# EAGLE design board (EAGLE 9.6.2)
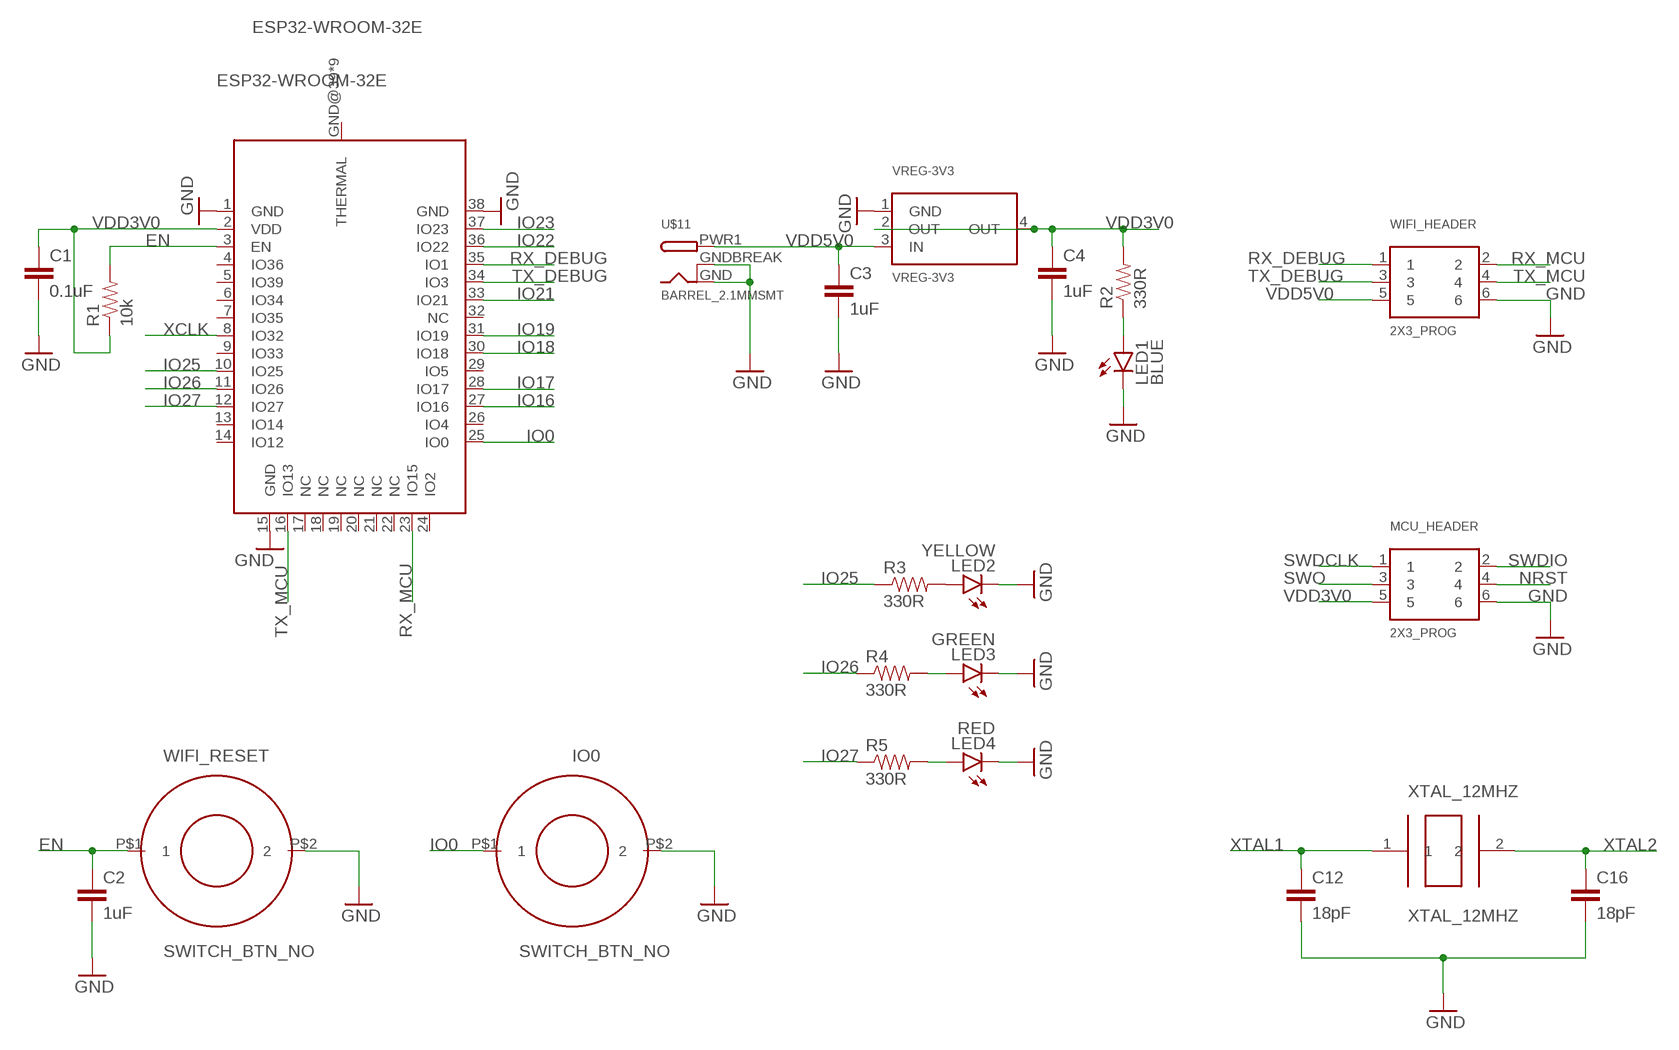
[diagram p0: schematic, sheet 1, part 1 of 2]
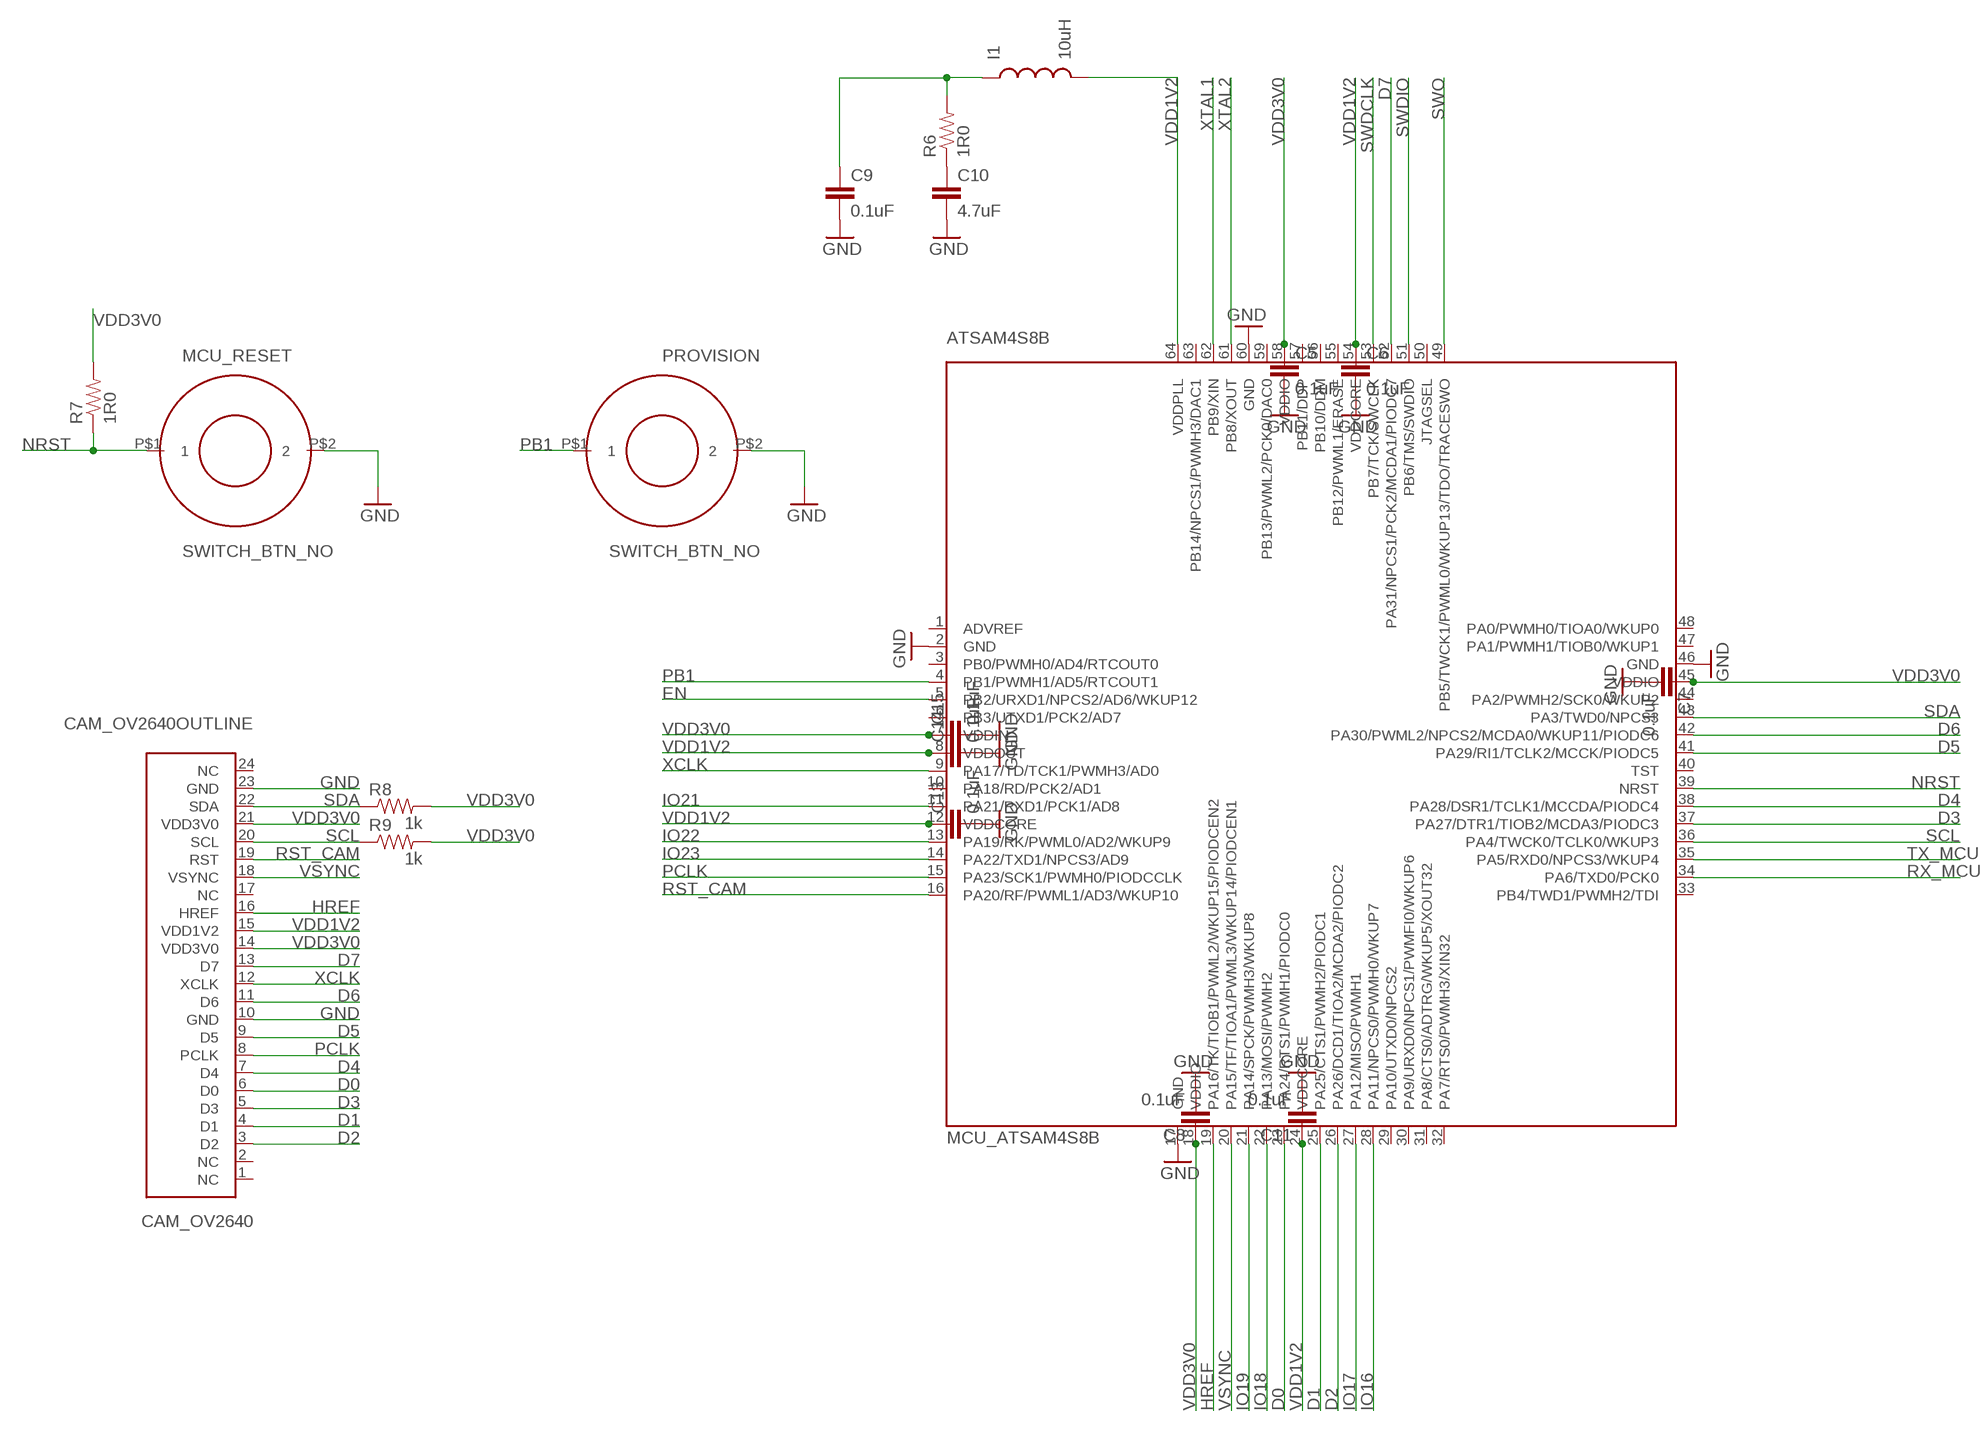
[diagram p1: schematic, sheet 1, part 2 of 2]

## Parts
ATSAM4S8B  MCU_ATSAM4S8B  [QFP50P1200X1200X160-64N]
C1  0.1uF  CAP  [0805]
C2  1uF  CAP  [0805]
C3  1uF  CAP  [0805]
C4  1uF  CAP  [0805]
C5  0.1uF  CAP  [0805]
C6  0.1uF  CAP  [0805]
C7  0.1uF  CAP  [0805]
C8  0.1uF  CAP  [0805]
C9  0.1uF  CAP  [0805]
C10  4.7uF  CAP  [0805]
C11  0.1uF  CAP  [0805]
C12  18pF  CAP  [0805]
C13  0.1uF  CAP  [0805]
C14  0.1uF  CAP  [0805]
C15  0.1uF  CAP  [0805]
C16  18pF  CAP  [0805]
CAM_OV2640  CAM_OV2640OUTLINE  [CAM_CONN]
ESP32-WROOM-32E  ESP32-WROOM-32E  [ESP32-WROOM-32E]
I1  10uH  IND  [0805]
IO0  SWITCH_BTN_NO  [BTN_2]
LED1  BLUE  LED0603  [LED-0603]
LED2  YELLOW  LED0603  [LED-0603]
LED3  GREEN  LED0603  [LED-0603]
LED4  RED  LED0603  [LED-0603]
MCU_HEADER  2X3_PROG  [2X3_0.1IN]
MCU_RESET  SWITCH_BTN_NO  [BTN_2]
PROVISION  SWITCH_BTN_NO  [BTN_2]
R1  10k  RES  [0805]
R2  330R  RES  [0805]
R3  330R  RES  [0805]
R4  330R  RES  [0805]
R5  330R  RES  [0805]
R6  1R0  RES  [0805]
R7  1R0  RES  [0805]
R8  1k  RES  [0805]
R9  1k  RES  [0805]
U$11  BARREL_2.1MMSMT  [DCJACK_2MM_SMT]
VREG-3V3  VREG-3V3  [R-PDSO-G4_TI]
WIFI_HEADER  2X3_PROG  [2X3_0.1IN]
WIFI_RESET  SWITCH_BTN_NO  [BTN_2]
XTAL_12MHZ  XTAL_12MHZ  [ABM7-16.000MHZ-D2Y-T]

## Nets
D0: ATSAM4S8B.23(PA24/RTS1/PWMH1/PIODC0) CAM_OV2640.6(D0)
D1: ATSAM4S8B.25(PA25/CTS1/PWMH2/PIODC1) CAM_OV2640.4(D1)
D2: ATSAM4S8B.26(PA26/DCD1/TIOA2/MCDA2/PIODC2) CAM_OV2640.3(D2)
D3: ATSAM4S8B.37(PA27/DTR1/TIOB2/MCDA3/PIODC3) CAM_OV2640.5(D3)
D4: ATSAM4S8B.38(PA28/DSR1/TCLK1/MCCDA/PIODC4) CAM_OV2640.7(D4)
D5: ATSAM4S8B.41(PA29/RI1/TCLK2/MCCK/PIODC5) CAM_OV2640.9(D5)
D6: ATSAM4S8B.42(PA30/PWML2/NPCS2/MCDA0/WKUP11/PIODC6) CAM_OV2640.11(D6)
D7: ATSAM4S8B.52(PA31/NPCS1/PCK2/MCDA1/PIODC7) CAM_OV2640.13(D7)
EN: ATSAM4S8B.5(PB2/URXD1/NPCS2/AD6/WKUP12) C2.1 ESP32-WROOM-32E.3(EN) R1.2 WIFI_RESET.P$1
GND: ATSAM4S8B.2(GND) ATSAM4S8B.17(GND) ATSAM4S8B.46(GND) ATSAM4S8B.60(GND) C1.2 C2.2 C3.2 C4.2 C5.2 C6.2 C7.2 C8.2 C9.2 C10.2 C11.2 C12.2 C13.2 C14.2 C15.2 C16.2 CAM_OV2640.10(GND) CAM_OV2640.23(GND) ESP32-WROOM-32E.1(GND) ESP32-WROOM-32E.15(GND) ESP32-WROOM-32E.38(GND) IO0.P$2 LED1.C LED2.C LED3.C LED4.C MCU_HEADER.6 MCU_RESET.P$2 PROVISION.P$2 U$11.GND U$11.GNDBREAK VREG-3V3.1(GND) WIFI_HEADER.6 WIFI_RESET.P$2
HREF: ATSAM4S8B.19(PA16/TK/TIOB1/PWML2/WKUP15/PIODCEN2) CAM_OV2640.16(HREF)
IO0: ESP32-WROOM-32E.25(IO0) IO0.P$1
IO16: ATSAM4S8B.28(PA11/NPCS0/PWMH0/WKUP7) ESP32-WROOM-32E.27(IO16)
IO17: ATSAM4S8B.27(PA12/MISO/PWMH1) ESP32-WROOM-32E.28(IO17)
IO18: ATSAM4S8B.22(PA13/MOSI/PWMH2) ESP32-WROOM-32E.30(IO18)
IO19: ATSAM4S8B.21(PA14/SPCK/PWMH3/WKUP8) ESP32-WROOM-32E.31(IO19)
IO21: ATSAM4S8B.11(PA21/RXD1/PCK1/AD8) ESP32-WROOM-32E.33(IO21)
IO22: ATSAM4S8B.13(PA19/RK/PWML0/AD2/WKUP9) ESP32-WROOM-32E.36(IO22)
IO23: ATSAM4S8B.14(PA22/TXD1/NPCS3/AD9) ESP32-WROOM-32E.37(IO23)
IO25: ESP32-WROOM-32E.10(IO25) R3.1
IO26: ESP32-WROOM-32E.11(IO26) R4.1
IO27: ESP32-WROOM-32E.12(IO27) R5.1
N$1: LED1.A R2.1
N$2: LED2.A R3.2
N$3: LED3.A R4.2
N$4: LED4.A R5.2
N$5: C10.1 R6.1
N$6: C9.1 I1.1 R6.2
NRST: ATSAM4S8B.39(NRST) MCU_HEADER.4 MCU_RESET.P$1 R7.1
PB1: ATSAM4S8B.4(PB1/PWMH1/AD5/RTCOUT1) PROVISION.P$1
PCLK: ATSAM4S8B.15(PA23/SCK1/PWMH0/PIODCCLK) CAM_OV2640.8(PCLK)
RST_CAM: ATSAM4S8B.16(PA20/RF/PWML1/AD3/WKUP10) CAM_OV2640.19(RST)
RX_DEBUG: ESP32-WROOM-32E.35(IO1) WIFI_HEADER.1
RX_MCU: ATSAM4S8B.34(PA6/TXD0/PCK0) ESP32-WROOM-32E.23(IO15) WIFI_HEADER.2
SCL: ATSAM4S8B.36(PA4/TWCK0/TCLK0/WKUP3) CAM_OV2640.20(SCL) R9.1
SDA: ATSAM4S8B.43(PA3/TWD0/NPCS3) CAM_OV2640.22(SDA) R8.1
SWDCLK: ATSAM4S8B.53(PB7/TCK/SWCLK) MCU_HEADER.1
SWDIO: ATSAM4S8B.51(PB6/TMS/SWDIO) MCU_HEADER.2
SWO: ATSAM4S8B.49(PB5/TWCK1/PWML0/WKUP13/TDO/TRACESWO) MCU_HEADER.3
TX_DEBUG: ESP32-WROOM-32E.34(IO3) WIFI_HEADER.3
TX_MCU: ATSAM4S8B.35(PA5/RXD0/NPCS3/WKUP4) ESP32-WROOM-32E.16(IO13) WIFI_HEADER.4
VDD1V2: ATSAM4S8B.8(VDDOUT) ATSAM4S8B.12(VDDCORE) ATSAM4S8B.24(VDDCORE) ATSAM4S8B.54(VDDCORE) ATSAM4S8B.64(VDDPLL) C6.1 C11.1 C13.1 C14.1 CAM_OV2640.15(VDD1V2) I1.2
VDD3V0: ATSAM4S8B.7(VDDIN) ATSAM4S8B.18(VDDIO) ATSAM4S8B.45(VDDIO) ATSAM4S8B.58(VDDIO) C1.1 C4.1 C5.1 C7.1 C8.1 C15.1 CAM_OV2640.14(VDD3V0) CAM_OV2640.21(VDD3V0) ESP32-WROOM-32E.2(VDD) MCU_HEADER.5 R1.1 R2.2 R7.2 R8.2 R9.2 VREG-3V3.2(OUT) VREG-3V3.4(OUT)
VDD5V0: C3.1 U$11.PWR1(PWR) VREG-3V3.3(IN) WIFI_HEADER.5
VSYNC: ATSAM4S8B.20(PA15/TF/TIOA1/PWML3/WKUP14/PIODCEN1) CAM_OV2640.18(VSYNC)
XCLK: ATSAM4S8B.9(PA17/TD/TCK1/PWMH3/AD0) CAM_OV2640.12(XCLK) ESP32-WROOM-32E.8(IO32)
XTAL1: ATSAM4S8B.62(PB9/XIN) C12.1 XTAL_12MHZ.1
XTAL2: ATSAM4S8B.61(PB8/XOUT) C16.1 XTAL_12MHZ.2
Unconnected: ATSAM4S8B.1(ADVREF) ATSAM4S8B.3(PB0/PWMH0/AD4/RTCOUT0) ATSAM4S8B.6(PB3/UTXD1/PCK2/AD7) ATSAM4S8B.10(PA18/RD/PCK2/AD1) ATSAM4S8B.29(PA10/UTXD0/NPCS2) ATSAM4S8B.30(PA9/URXD0/NPCS1/PWMFI0/WKUP6) ATSAM4S8B.31(PA8/CTS0/ADTRG/WKUP5/XOUT32) ATSAM4S8B.32(PA7/RTS0/PWMH3/XIN32) ATSAM4S8B.33(PB4/TWD1/PWMH2/TDI) ATSAM4S8B.40(TST) ATSAM4S8B.44(PA2/PWMH2/SCK0/WKUP2) ATSAM4S8B.47(PA1/PWMH1/TIOB0/WKUP1) ATSAM4S8B.48(PA0/PWMH0/TIOA0/WKUP0) ATSAM4S8B.50(JTAGSEL) ATSAM4S8B.55(PB12/PWML1/ERASE) ATSAM4S8B.56(PB10/DDM) ATSAM4S8B.57(PB11/DDP) ATSAM4S8B.59(PB13/PWML2/PCK0/DAC0) ATSAM4S8B.63(PB14/NPCS1/PWMH3/DAC1) CAM_OV2640.1(NC) CAM_OV2640.2(NC) CAM_OV2640.17(NC) CAM_OV2640.24(NC) ESP32-WROOM-32E.4(IO36) ESP32-WROOM-32E.5(IO39) ESP32-WROOM-32E.6(IO34) ESP32-WROOM-32E.7(IO35) ESP32-WROOM-32E.9(IO33) ESP32-WROOM-32E.13(IO14) ESP32-WROOM-32E.14(IO12) ESP32-WROOM-32E.17(NC) ESP32-WROOM-32E.18(NC) ESP32-WROOM-32E.19(NC) ESP32-WROOM-32E.20(NC) ESP32-WROOM-32E.21(NC) ESP32-WROOM-32E.22(NC) ESP32-WROOM-32E.24(IO2) ESP32-WROOM-32E.26(IO4) ESP32-WROOM-32E.29(IO5) ESP32-WROOM-32E.32(NC) ESP32-WROOM-32E.GND@39(THERMAL) ESP32-WROOM-32E.GND@40(THERMAL) ESP32-WROOM-32E.GND@41(THERMAL) ESP32-WROOM-32E.GND@42(THERMAL) ESP32-WROOM-32E.GND@43(THERMAL) ESP32-WROOM-32E.GND@44(THERMAL) ESP32-WROOM-32E.GND@45(THERMAL) ESP32-WROOM-32E.GND@46(THERMAL) ESP32-WROOM-32E.GND@47(THERMAL)

## Library data of the parts
ATSAM4S8B = Ilya_Teach:MCU_ATSAM4S8B
C1-C16 = Ilya_Teach:CAP
CAM_OV2640 = Ilya_Teach:CAM_OV2640
ESP32-WROOM-32E = Ilya_Teach:ESP32-WROOM-32E
I1 = Ilya_Teach:IND
IO0 MCU_RESET PROVISION WIFI_RESET = Ilya_Teach:SWITCH_BTN_NO
LED1-LED4 = Ilya_Teach:LED: LEDs Standard schematic elements and footprints for 5mm, 3mm, 1206, and 0603 sized LEDs. 5mm - Spark Fun Electronics SKU : COM-00529 (and others)
MCU_HEADER WIFI_HEADER = Ilya_Teach:2X3_PROG
R1-R9 = Ilya_Teach:RES
U$11 = Ilya_Teach:BARREL_2.1MM
VREG-3V3 = Ilya_Teach:VREG-3V3
XTAL_12MHZ = Ilya_Teach:XTAL_12MHZ

## Board
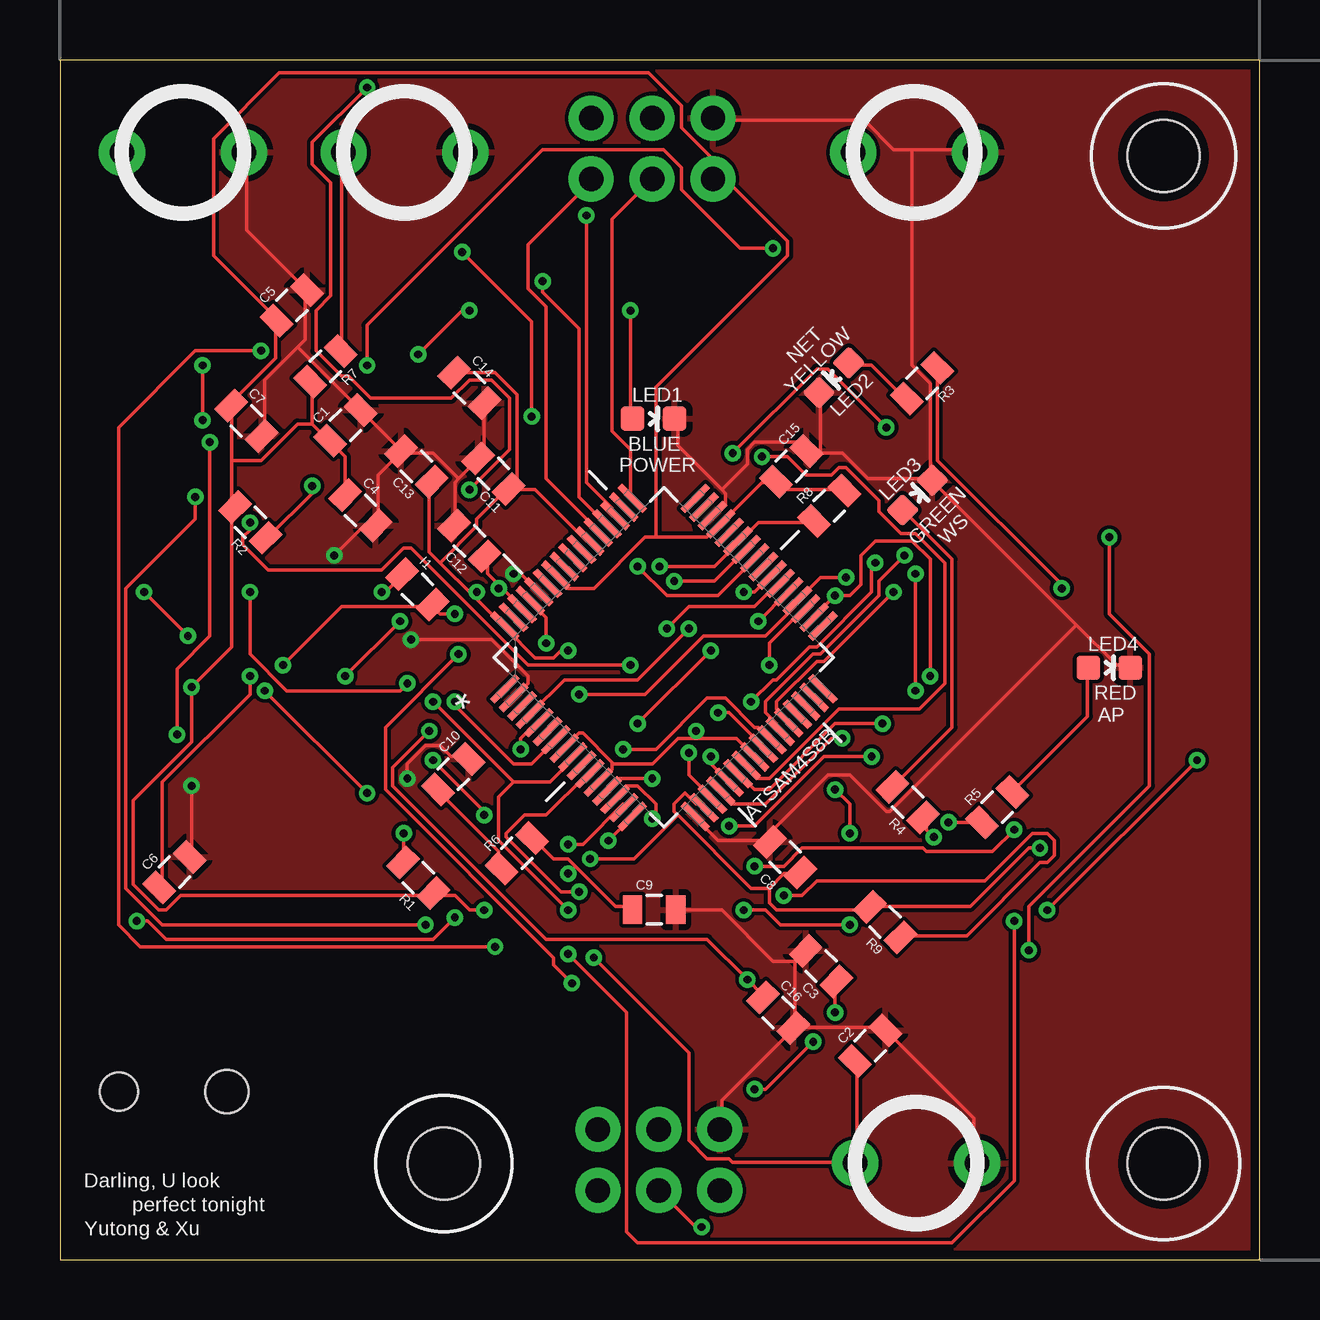
[diagram p2: board, top side]
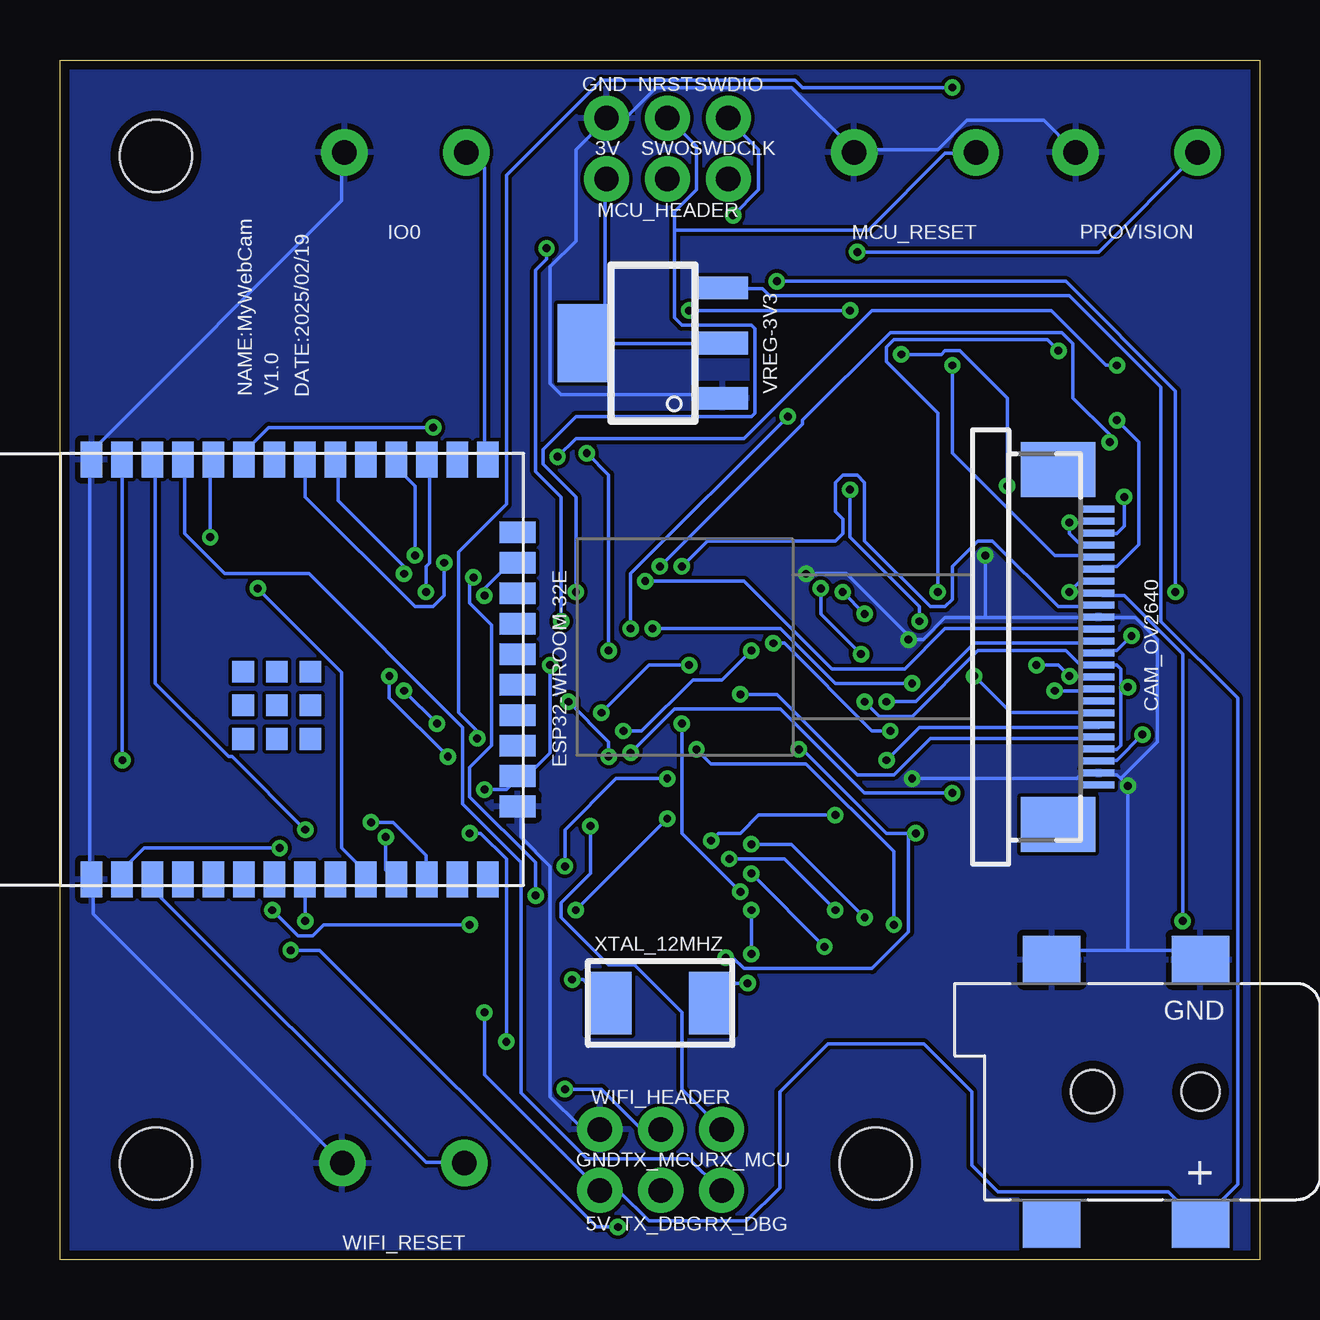
[diagram p3: board, bottom side, seen from below]

Size 50 x 50 mm. Coordinates in mm from the lower left corner, seen from the top.
Outline: 0,0 50,0 50,50 0,50 0,0
Copper layers (1*16): Top 0.0356mm / dielectric 1.5011mm / Bottom 0.0356mm
Design rules "LaenPCBOrder": minimum track width 6mil, minimum drill 13mil, track to track 6mil, track to pad 6mil, pad to pad 6mil, via to via 6mil, smd to smd 6mil, copper to edge 15mil, drill to drill 6mil, minimum pad ring 7mil, minimum via ring 7mil, stop-mask expansion 3mil, vias tented up to drill 0mil, thermal gap 10mil
Holes 3 mm at 46,46 46,4 16,4

### Footprints (pad centres in the part's own frame; a part is rotated, then mirrored left to right if it is on the bottom)
QFP50P1200X1200X160-64N = smd 1.473 x 0.279: 1 -5.613,3.759; 2 -5.613,3.251; 3 -5.613,2.743; 4 -5.613,2.261; 5 -5.613,1.753; 6 -5.613,1.245; 7 -5.613,0.762; 8 -5.613,0.254; 9 -5.613,-0.254; 10 -5.613,-0.762; 11 -5.613,-1.245; 12 -5.613,-1.753; 13 -5.613,-2.261; 14 -5.613,-2.743; 15 -5.613,-3.251; 16 -5.613,-3.759; 33 5.613,-3.759; 34 5.613,-3.251; 35 5.613,-2.743; 36 5.613,-2.261; 37 5.613,-1.753; 38 5.613,-1.245; 39 5.613,-0.762; 40 5.613,-0.254; 41 5.613,0.254; 42 5.613,0.762; 43 5.613,1.245; 44 5.613,1.753; 45 5.613,2.261; 46 5.613,2.743; 47 5.613,3.251; 48 5.613,3.759 | smd 0.279 x 1.473: 17 -3.759,-5.613; 18 -3.251,-5.613; 19 -2.743,-5.613; 20 -2.261,-5.613; 21 -1.753,-5.613; 22 -1.245,-5.613; 23 -0.762,-5.613; 24 -0.254,-5.613; 25 0.254,-5.613; 26 0.762,-5.613; 27 1.245,-5.613; 28 1.753,-5.613; 29 2.261,-5.613; 30 2.743,-5.613; 31 3.251,-5.613; 32 3.759,-5.613; 49 3.759,5.613; 50 3.251,5.613; 51 2.743,5.613; 52 2.261,5.613; 53 1.753,5.613; 54 1.245,5.613; 55 0.762,5.613; 56 0.254,5.613; 57 -0.254,5.613; 58 -0.762,5.613; 59 -1.245,5.613; 60 -1.753,5.613; 61 -2.261,5.613; 62 -2.743,5.613; 63 -3.251,5.613; 64 -3.759,5.613
0805 = smd 0.8 x 1.2: 1 -0.9,0; 2 0.9,0
CAM_CONN = smd 0.3 x 1.3: 1 -5.75,3.25; 2 -5.25,3.25; 3 -4.75,3.25; 4 -4.25,3.25; 5 -3.75,3.25; 6 -3.25,3.25; 7 -2.75,3.25; 8 -2.25,3.25; 9 -1.75,3.25; 10 -1.25,3.25; 11 -0.75,3.25; 12 -0.25,3.25; 13 0.25,3.25; 14 0.75,3.25; 15 1.25,3.25; 16 1.75,3.25; 17 2.25,3.25; 18 2.75,3.25; 19 3.25,3.25; 20 3.75,3.25; 21 4.25,3.25; 22 4.75,3.25; 23 5.25,3.25; 24 5.75,3.25 | smd 2.3 x 3.1: P1 -7.4,1.55; P2 7.4,1.55
ESP32-WROOM-32E = smd 1.5 x 0.9: 1 -8.75,8.255; 2 -8.75,6.985; 3 -8.75,5.715; 4 -8.75,4.445; 5 -8.75,3.175; 6 -8.75,1.905; 7 -8.75,0.635; 8 -8.75,-0.635; 9 -8.75,-1.905; 10 -8.75,-3.175; 11 -8.75,-4.445; 12 -8.75,-5.715; 13 -8.75,-6.985; 14 -8.75,-8.255; 25 8.75,-8.255; 26 8.75,-6.985; 27 8.75,-5.715; 28 8.75,-4.445; 29 8.75,-3.175; 30 8.75,-1.905; 31 8.75,-0.635; 32 8.75,0.635; 33 8.75,1.905; 34 8.75,3.175; 35 8.75,4.445; 36 8.75,5.715; 37 8.75,6.985; 38 8.75,8.255 | smd 0.9 x 1.5: 15 -5.715,-9.505; 16 -4.445,-9.505; 17 -3.175,-9.505; 18 -1.905,-9.505; 19 -0.635,-9.505; 20 0.635,-9.505; 21 1.905,-9.505; 22 3.175,-9.505; 23 4.445,-9.505; 24 5.715,-9.505 | smd 0.9 x 0.9: GND@39 -2.9,1.935; GND@40 -1.5,1.935; GND@41 -0.1,1.935; GND@42 -2.9,0.535; GND@43 -1.5,0.535; GND@44 -0.1,0.535; GND@45 -2.9,-0.865; GND@46 -1.5,-0.865; GND@47 -0.1,-0.865
BTN_2 = drill 1.016 pad 1.93: P$1 -2.54,0; P$2 2.54,0
LED-0603 = smd 1 x 1: A 0,-0.877; C 0,0.877
2X3_0.1IN = drill 1.016 pad 1.88: 1 -2.54,-1.27; 2 -2.54,1.27; 3 0,-1.27; 4 0,1.27; 5 2.54,-1.27; 6 2.54,1.27
DCJACK_2MM_SMT = smd 2.4 x 2: GND -2.54,-5.5; GNDBREAK 3.66,-5.5; PWR1 -2.54,5.5; PWR2 3.66,5.5 | hole 1.6: -2.54,0 | hole 1.8: 1.96,0
R-PDSO-G4_TI = smd 0.95 x 2.15: 1 -2.3,-2.9; 2 0,-2.9; 3 2.3,-2.9 | smd 3.25 x 2.15: 4 0,2.9
ABM7-16.000MHZ-D2Y-T = smd 1.9 x 2.6: 1 -2.15,0; 2 2.15,0

### Placement (x,y rotation side)
ATSAM4S8B  25.17,25.1 45 top
C1  11.9,34.77 45 top
C2  33.77,8.91 45 top
C3  31.72,12.23 135 top
C4  12.53,31.23 315 top
C5  9.66,39.77 45 top
C6  4.77,16.15 45 top
C7  7.77,34.96 315 top
C8  30.23,16.77 135 top
C9  24.77,14.58 0 top
C10  16.39,20.23 45 top
C11  18.07,32.76 135 top
C12  17.07,29.95 135 top
C13  14.86,33.07 135 top
C14  17.07,36.33 315 top
C15  30.48,33.07 45 top
C16  29.93,10.29 315 top
CAM_OV2640  9.95,25.53 270 bottom
ESP32-WROOM-32E  40.43,24.6 90 bottom
I1  14.9,27.93 315 top
IO0  35.6,46.15 0 top
LED1  24.74,35.05 270 top
LED2  32.26,36.76 135 top
LED3  35.74,31.86 315 top
LED4  43.74,24.67 270 top
MCU_HEADER  24.68,46.31 0 top
MCU_RESET  14.36,46.15 0 top
PROVISION  5.12,46.15 0 top
R1  14.93,15.91 135 top
R2  7.93,30.72 135 top
R3  35.93,36.53 225 top
R4  35.34,19.07 135 top
R5  39.07,18.85 45 top
R6  19.04,16.93 45 top
R7  11.07,37.23 225 top
R8  32.07,31.42 45 top
R9  34.39,14.07 135 top
U$11  5,7 180 bottom
VREG-3V3  25.29,38.2 90 bottom
WIFI_HEADER  24.96,4.15 0 top
WIFI_RESET  35.69,4.02 0 top
XTAL_12MHZ  24.98,10.69 180 bottom

### Tracks (layer width: path | path; a pad name or v marks a point on that pad's centre or on a via)
D0  (via drill 0.33)
  Top 0.152: v5.94,37.27 v5.94,34.98 | v29.26,33.46 30.33,33.46 31.09,32.7 32.16,32.7 32.46,33 32.77,33 34.14,31.63 34.14,31.18 35.05,30.26 35.66,30.26 36.88,29.04 36.88,24.01 35.81,22.95 32.46,22.95 29.57,20.05 29.11,20.05 28.65,20.51 ATSAM4S8B.23
  Bottom 0.152: v5.94,34.98 5.03,34.07 5.03,29.8 5.94,28.89 6.55,28.89 CAM_OV2640.6 | v5.94,37.27 6.4,37.27 8.69,39.56 16.15,39.56 21.49,34.22 28.5,34.22 v29.26,33.46
D1  (via drill 0.33)
  Top 0.152: v7.92,30.72 7.92,30.41 7.62,30.11 7.62,29.8 8.69,28.74 13.41,28.74 14.33,29.65 14.63,29.65 19.51,24.77 v23.77,24.77 | v27.43,22.79 27.89,22.79 29.26,21.42 ATSAM4S8B.25
  Bottom 0.152: v7.92,30.72 7.92,30.26 7.47,29.8 6.71,29.8 CAM_OV2640.4 | v23.77,24.77 25.45,24.77 v27.43,22.79
D2  (via drill 0.33)
  Top 0.152: v5.64,31.79 5.64,30.87 2.74,27.98 2.74,15.48 4.27,13.95 v15.24,13.95 | v23.47,21.27 24.84,21.27 26.98,23.4 27.74,23.4 28.96,22.18 29.11,22.18 29.57,21.73 ATSAM4S8B.26
  Bottom 0.152: v5.64,31.79 5.64,30.57 5.94,30.26 6.55,30.26 CAM_OV2640.3 | v15.24,13.95 15.24,17 18.9,20.66 22.86,20.66 v23.47,21.27
D3  (via drill 0.33)
  Top 0.152: v12.8,37.27 12.8,38.95 20.12,46.26 25.15,46.26 25.91,45.5 25.91,44.59 28.35,42.15 v29.72,42.15 | v29.11,26.6 30.33,27.82 ATSAM4S8B.37
  Bottom 0.152: v12.8,37.27 12.8,33.61 8.53,29.35 6.71,29.35 CAM_OV2640.5 | v29.72,42.15 29.72,41.69 30.18,41.23 30.18,32.85 29.11,31.79 v29.11,26.6
D4  (via drill 0.33)
  Top 0.152: v7.92,27.82 7.92,25.23 9.45,23.71 14.17,23.71 v14.48,24.01 | v25.3,26.3 26.21,27.21 28.96,27.21 29.87,28.13 ATSAM4S8B.38
  Bottom 0.152: v7.92,27.82 7.47,28.28 CAM_OV2640.7 | v14.48,24.01 17.68,24.01 19.96,26.3 v25.3,26.3
D5  (via drill 0.33)
  Top 0.152: v24.08,28.89 25.3,27.67 27.43,27.67 28.96,29.19 ATSAM4S8B.41
  Bottom 0.152: v24.08,28.89 23.01,29.96 17.68,29.96 17.37,30.26 17.37,30.87 17.68,31.18 17.68,32.39 17.37,32.7 16.76,32.7 16.46,32.39 16.46,29.96 13.72,27.21 13.11,27.21 12.8,27.52 12.8,28.89 11.73,29.96 11.12,29.96 8.38,27.21 6.71,27.21 CAM_OV2640.9
D6  (via drill 0.33)
  Top 0.152: v25.6,28.28 27.28,28.28 28.5,29.5 ATSAM4S8B.42
  Bottom 0.152: v25.6,28.28 21.49,28.28 17.83,24.62 14.78,24.62 13.11,26.3 6.71,26.3 CAM_OV2640.11
D7  (via drill 0.33)
  Top 0.152: v3.5,27.82 v5.33,25.99 | v20.12,40.78 20.12,40.32 21.64,38.8 21.64,31.79 22.71,30.72 ATSAM4S8B.52
  Bottom 0.152: v5.33,25.99 5.94,25.38 6.55,25.38 CAM_OV2640.13 | v3.5,27.82 3.5,36.2 8.08,40.78 v20.12,40.78
EN  (via drill 0.33)
  Top 0.152: C2.1 33.22,8.16 33.22,4.05 WIFI_RESET.P$1 33.07,4.05 28.04,4.05 27.89,4.2 26.98,4.2 26.21,4.96 26.21,8.62 v22.25,12.58 | v14.33,17.76 14.33,16.7 R1.2 | v19.2,21.27 19.2,21.73 19.81,22.34 ATSAM4S8B.5
  Bottom 0.152: ESP32-WROOM-32E.3 46.02,15.78 46.02,15.33 34.75,4.05 33.22,4.05 WIFI_RESET.P$1 | 14.63,17.76 15.54,17.76 19.05,21.27 v19.2,21.27 | v22.25,12.58 21.95,12.58 21.49,12.12 16.15,12.12 14.63,13.65 14.63,17.76 | 14.63,17.76 v14.33,17.76
GND  (via drill 0.33)
  Top 0.152: 27.58,32.09 27.74,31.94 27.74,31.48 27.28,31.02 ATSAM4S8B.46 | 27.58,32.09 25.76,33.92 25.76,34.98 LED1.C | ATSAM4S8B.17 26.52,18.37 27.43,17.46 29.57,17.46 C8.2 29.72,17.46 29.72,17.92 32,20.2 32.92,20.2 34.44,18.68 34.59,18.68 42.37,26.45 | 36.27,32.55 33.68,32.55 32.61,33.61 31.7,33.61 | 31.7,33.61 31.24,33.61 C15.2 | 42.37,26.45 36.42,32.39 LED3.C 36.27,32.55 | 42.37,26.45 44.04,24.77 44.5,24.77 LED4.C | 31.7,33.61 31.7,36.05 LED2.C | 31.7,33.61 C15.2 | 27.58,32.09 28.65,33.16 28.65,33.77 28.96,34.07 30.79,34.07 31.09,33.77 C15.2 | 35.51,46.26 34.75,46.26 33.53,47.48 27.28,47.48 MCU_HEADER.6 | 35.51,46.26 38.1,46.26 IO0.P$2 | 9.91,38.03 10.21,38.34 10.21,40.32 C5.2 10.21,40.47 7.77,42.91 7.77,46.11 PROVISION.P$2 | 9.91,38.03 8.53,36.66 8.53,34.38 C7.2 | 16.61,32.55 17.37,33.31 C11.2 17.53,33.46 17.68,33.61 17.68,35.59 C14.2 | 16.61,32.55 16.46,32.39 16.46,30.72 C12.2 | C13.2 14.17,33.61 13.26,32.7 13.26,30.72 C4.2 13.11,30.57 12.65,30.57 v11.43,29.35 | C13.2 14.17,33.77 12.65,35.29 C1.2 12.5,35.44 9.91,38.03 | 16.61,32.55 15.54,33.61 14.33,33.61 C13.2 | 36.27,32.55 36.27,36.51 35.51,37.27 35.51,46.26 | 30.63,12.43 30.63,9.69 | 30.63,12.43 30.94,12.73 C3.2 | 30.63,12.43 29.72,12.43 27.58,14.56 25.76,14.56 C9.2 | 30.63,9.69 34.29,9.69 C2.2 34.44,9.53 38.1,5.88 38.1,4.05 WIFI_RESET.P$2 | 30.63,9.69 C16.2 30.48,9.53 27.58,6.64 27.58,5.57 WIFI_HEADER.6 | v5.49,19.75 5.49,16.85 C6.2 | v14.48,20.05 14.48,20.66 15.24,21.42 15.85,21.42 16.31,20.96 16.92,20.96 C10.2 | v14.63,25.84 17.98,25.84 19.51,24.32 19.51,24.01 19.05,23.55 ATSAM4S8B.2 | v18.9,28.58 19.2,28.58 19.81,27.98 ATSAM4S8B.60
  Bottom 0.152: VREG-3V3.1 22.4,36.05 29.11,36.05 29.57,36.51 29.57,41.39 28.5,42.45 28.5,46.26 27.28,47.48 MCU_HEADER.6 27.13,47.63 26.36,47.63 25.15,48.85 19.51,48.85 16.92,46.26 MCU_RESET.P$2 16.76,46.26 13.41,46.26 12.19,47.48 8.99,47.48 7.77,46.26 PROVISION.P$2 | WIFI_RESET.P$2 38.25,4.05 48.62,14.41 48.62,15.78 ESP32-WROOM-32E.1 48.77,15.94 48.77,33.31 ESP32-WROOM-32E.38 48.62,33.46 48.62,33.77 38.25,44.13 38.25,46.11 IO0.P$2 | ESP32-WROOM-32E.15 30.79,18.83 30.79,17.61 29.57,16.39 29.57,6.79 28.35,5.57 27.58,5.57 WIFI_HEADER.6 | 5.49,12.89 8.23,12.89 8.53,12.58 U$11.GNDBREAK | 5.49,12.89 3.66,12.89 3.35,12.58 2.59,12.58 U$11.GND | 5.79,20.05 5.94,20.2 6.55,20.2 CAM_OV2640.23 6.71,20.2 7.47,20.2 7.62,20.05 v14.48,20.05 | 5.79,20.05 v5.49,19.75 5.49,12.89 | 5.79,20.05 4.27,21.57 4.27,25.84 5.18,26.76 6.55,26.76 CAM_OV2640.10 6.71,26.76 11.43,26.76 | 14.48,25.84 14.02,25.84 13.11,26.76 11.43,26.76 | v18.9,28.58 17.22,28.58 14.48,25.84 | 14.48,25.84 v14.63,25.84 | 11.43,26.76 v11.43,29.35
  pour Top: -1,51 50,51 51,50 51,0 50,-1 0,-1 -1,0
  pour Bottom: -2,51 -2,-1 0,-3 51,-3 53,-1 53,48 49,52 -1,52
HREF  (via drill 0.33)
  Top 0.152: v12.8,19.44 v8.53,23.71 | v26.21,21.12 26.21,20.2 27.13,19.29 ATSAM4S8B.19
  Bottom 0.152: v8.53,23.71 6.71,23.71 CAM_OV2640.16 | v12.8,19.44 16.46,19.44 19.96,22.95 24.38,22.95 v26.21,21.12
IO0
  Bottom 0.152: ESP32-WROOM-32E.25 32.31,33.46 32.31,45.5 32.92,46.11 IO0.P$1
IO16  (via drill 0.33)
  Top 0.152: v34.75,27.82 31.85,24.93 31.55,24.93 29.87,23.25 29.87,22.95 30.33,22.49 ATSAM4S8B.28
  Bottom 0.152: v34.75,27.82 34.75,28.89 34.59,29.04 34.59,33.31 ESP32-WROOM-32E.27
IO17  (via drill 0.33)
  Top 0.152: v35.2,29.35 34.14,28.28 34.14,27.67 31.7,25.23 31.39,25.23 29.41,23.25 29.41,22.79 29.87,22.34 29.87,22.03 ATSAM4S8B.27
  Bottom 0.152: v35.2,29.35 35.2,32.24 35.97,33 35.97,33.31 ESP32-WROOM-32E.28
IO18  (via drill 0.33)
  Top 0.152: v34.29,22.34 32.31,22.34 29.57,19.59 28.96,19.59 28.35,20.2 ATSAM4S8B.22 | v35.66,28.58 v35.66,23.71
  Bottom 0.152: v35.66,23.71 v34.29,22.34 | v35.66,28.58 35.66,28.89 38.41,31.63 38.41,33.31 ESP32-WROOM-32E.30
IO19  (via drill 0.33)
  Top 0.152: v27.13,20.96 27.13,20.66 27.89,19.9 ATSAM4S8B.21 | v28.8,23.25 29.72,24.16 29.87,24.16 31.24,25.54 31.55,25.54 33.83,27.82 33.83,28.89 v33.98,29.04
  Bottom 0.152: v27.13,20.96 27.13,21.57 v28.8,23.25 | v33.98,29.04 33.98,27.67 34.44,27.21 35.2,27.21 39.78,31.79 39.78,33.31 ESP32-WROOM-32E.31
IO21  (via drill 0.33)
  Top 0.152: v21.64,15.33 20.88,15.33 18.59,17.61 18.59,17.76 19.36,18.53 20.27,18.53 21.95,20.2 ATSAM4S8B.11 | v27.13,25.38 v24.08,22.34 | v28.04,33.61 31.55,37.12 32,37.12 v34.44,34.68
  Bottom 0.152: v21.64,15.33 24.08,17.76 v24.08,22.34 | v27.13,25.38 27.13,32.7 v28.04,33.61 | v34.44,34.68 41.3,34.68 42.22,33.77 42.22,33.46 ESP32-WROOM-32E.33
IO22  (via drill 0.33)
  Top 0.152: v24.69,20.05 23.32,20.05 22.86,19.59 ATSAM4S8B.13 | v28.96,16.39 30.18,16.39 30.94,17.15 35.97,17.15 36.12,17 38.86,17 v39.78,17.92
  Bottom 0.152: v24.69,20.05 26.82,20.05 28.96,17.92 v28.96,16.39 | v39.78,17.92 42.82,20.96 42.98,20.96 46.02,24.01 46.02,33.31 ESP32-WROOM-32E.36
IO23  (via drill 0.33)
  Top 0.152: v24.69,18.37 24.84,18.53 24.84,18.98 24.08,19.75 23.62,19.75 23.16,19.29 ATSAM4S8B.14 | v28.5,14.56 29.41,14.56 30.02,13.95 v32.92,13.95 | v47.4,20.81 v41.15,14.56
  Bottom 0.152: v28.5,14.56 v24.69,18.37 | v32.92,13.95 39.01,13.95 39.47,13.5 40.08,13.5 v41.15,14.56 | v47.4,20.81 47.4,33.31 ESP32-WROOM-32E.37
IO25  (via drill 0.33)
  Top 0.152: v41.76,27.98 41.76,28.13 36.58,33.31 36.58,37.12 R3.1
  Bottom 0.152: v41.76,27.98 38.25,24.47 38.25,17.15 37.34,16.24 37.34,15.94 ESP32-WROOM-32E.10
IO26  (via drill 0.33)
  Top 0.152: v36.42,17.61 36.12,17.92 36.12,18.37 R4.1
  Bottom 0.152: v36.42,17.61 36.42,16.24 36.12,15.94 ESP32-WROOM-32E.11
IO27  (via drill 0.33)
  Top 0.152: v37.03,18.22 38.41,18.22 R5.1
  Bottom 0.152: v37.03,18.22 36.12,18.22 34.75,16.85 34.75,15.94 ESP32-WROOM-32E.12
N$1  (via drill 0.33)
  Top 0.152: v23.77,39.56 23.77,35.14 LED1.A | v17.07,39.56 16.76,39.56 v14.94,37.73 | v10.52,32.24 10.52,31.94 8.69,30.11 R2.1
  Bottom 0.152: v17.07,39.56 v23.77,39.56 | v14.94,37.73 13.26,37.73 13.11,37.88 12.5,37.88 10.52,35.9 v10.52,32.24
N$2
  Top 0.152: LED2.A 32.92,37.27 33.83,37.27 35.2,35.9 R3.2
N$3
  Top 0.152: LED3.A 35.2,31.18 37.19,29.19 37.19,22.18 34.75,19.75 R4.2
N$4
  Top 0.152: LED4.A 42.82,24.62 42.82,22.64 39.78,19.59 R5.2
N$5
  Top 0.152: R6.1 18.29,16.39 18.29,17 15.7,19.59 C10.1
N$6  (via drill 0.33)
  Top 0.152: 21.49,16.39 21.18,16.7 20.57,16.7 19.81,17.46 R6.2 | 21.49,16.39 23.16,14.72 23.77,14.72 C9.1 | v13.41,27.82 13.56,27.82 14.17,28.43 I1.1 | v8.38,37.88 5.64,37.88 2.44,34.68 2.44,13.95 3.35,13.04 v18.14,13.04 | 21.49,16.39 v21.18,16.09
  Bottom 0.152: v13.41,27.82 13.41,35.29 15.54,37.42 15.54,38.03 15.24,38.34 8.84,38.34 v8.38,37.88 | v21.18,16.09 v18.14,13.04
NRST  (via drill 0.33)
  Top 0.152: R7.1 11.73,37.88 11.73,46.11 MCU_RESET.P$1 | v28.5,27.82 28.96,27.82 29.57,28.43 ATSAM4S8B.39
  Bottom 0.152: v28.5,27.82 28.5,31.79 29.87,33.16 29.87,33.77 28.5,35.14 21.18,35.14 21.03,35.29 21.03,38.8 21.18,38.95 24.08,38.95 24.38,39.25 24.38,42.91 | 24.38,42.91 24.38,43.67 23.47,44.59 23.47,46.41 24.54,47.48 MCU_HEADER.4 | 24.38,42.91 16.31,42.91 13.11,46.11 11.89,46.11 MCU_RESET.P$1
PB1  (via drill 0.33)
  Top 0.152: v26.21,26.3 24.08,24.16 21.03,24.16 19.66,22.79 ATSAM4S8B.4 | v19.66,35.14 19.66,39.1 v16.76,42
  Bottom 0.152: v26.21,26.3 26.21,28.58 v19.66,35.14 | v16.76,42 6.71,42 2.59,46.11 PROVISION.P$1
PCLK  (via drill 0.33)
  Top 0.152: v3.2,14.11 3.66,14.11 4.42,13.34 15.54,13.34 v16.46,14.26 | v21.18,17.31 21.79,17.31 23.47,18.98 ATSAM4S8B.15
  Bottom 0.152: v3.2,14.11 3.2,25.23 5.64,27.67 6.55,27.67 CAM_OV2640.8 | v16.46,14.26 19.51,17.31 v21.18,17.31
RST_CAM  (via drill 0.33)
  Top 0.152: v15.54,20.81 17.68,18.68 v17.68,18.53 | v22.86,17.46 23.77,18.37 ATSAM4S8B.16
  Bottom 0.152: v15.54,20.81 14.17,22.18 6.71,22.18 CAM_OV2640.19 | v17.68,18.53 20.88,18.53 21.64,17.76 22.55,17.76 v22.86,17.46
RX_DEBUG
  Bottom 0.152: ESP32-WROOM-32E.35 44.81,33.31 44.81,30.26 43.13,28.58 39.62,28.58 33.22,22.18 33.22,18.98 30.79,16.55 30.79,6.94 28.04,4.2 23.77,4.2 22.55,2.98 WIFI_HEADER.1
RX_MCU  (via drill 0.33)
  Top 0.152: ATSAM4S8B.34 31.55,26.91 v32.31,27.67 32.92,27.67 33.38,28.13 33.38,29.35 33.98,29.96 35.51,29.96 36.27,29.19 v36.27,24.32 | v33.83,20.96 31.85,20.96 28.96,18.07 v27.89,18.07
  Bottom 0.152: v32.31,27.67 32.31,27.98 31.24,29.04 30.94,29.04 ESP32-WROOM-32E.23 | v36.27,24.32 36.27,23.4 v33.83,20.96 | v27.89,18.07 27.89,16.09 29.11,14.87 29.11,14.26 27.13,12.28 26.06,12.28 24.08,10.3 24.08,7.1 22.55,5.57 WIFI_HEADER.2
SCL  (via drill 0.33)
  Top 0.152: v30.18,15.17 30.94,15.17 31.55,15.78 38.56,15.78 40.54,17.76 41.15,17.76 41.45,17.46 41.45,16.85 41.15,16.55 40.84,16.55 37.8,13.5 35.05,13.5 R9.1 | v32.77,28.43 31.7,28.43 30.79,27.52 ATSAM4S8B.36 30.63,27.36 30.63,27.21 29.41,25.99 26.82,25.99 24.38,23.55 v21.64,23.55
  Bottom 0.152: v30.18,15.17 30.18,16.55 32.92,19.29 32.92,20.51 32,21.42 32,26.45 32.92,27.36 32.92,28.28 v32.77,28.43 | v21.64,23.55 20.12,23.55 16.76,20.2 15.24,20.2 13.72,21.73 6.71,21.73 CAM_OV2640.20
SDA  (via drill 0.33)
  Top 0.152: R8.1 31.39,30.72 29.11,30.72 28.35,29.96 ATSAM4S8B.43 28.19,29.8 27.28,28.89 v24.99,28.89 | v4.88,21.88 4.88,24.62 6.25,25.99 v6.25,34.07
  Bottom 0.152: v4.88,21.88 5.94,20.81 6.55,20.81 CAM_OV2640.22 | v6.25,34.07 6.25,34.38 7.77,35.9 7.77,38.19 8.23,38.64 15.39,38.64 19.05,34.98 19.05,34.83 v24.99,28.89
SWDCLK
  Top 0.152: ATSAM4S8B.53 22.4,30.41 20.27,32.55 20.27,39.71 19.51,40.47 19.51,42.3 22.1,44.89 MCU_HEADER.1
SWDIO  (via drill 0.33)
  Top 0.152: v21.95,43.52 21.95,32.39 23.01,31.33 23.01,31.02 ATSAM4S8B.51
  Bottom 0.152: v21.95,43.52 20.88,44.59 20.88,46.26 22.1,47.48 MCU_HEADER.2
SWO
  Top 0.152: ATSAM4S8B.49 23.77,31.79 23.77,33.77 23.01,34.53 23.01,43.37 24.54,44.89 MCU_HEADER.3
TX_DEBUG  (via drill 0.33)
  Top 0.152: v43.74,30.11 43.74,26.91 45.41,25.23 45.41,19.75 40.39,14.72 v40.39,12.89 | v26.75,1.36 26.48,1.36 WIFI_HEADER.3
  Bottom 0.152: v43.74,30.11 43.74,33.31 ESP32-WROOM-32E.34 | v40.39,12.89 39.17,12.89 27.64,1.36 v26.75,1.36
TX_MCU  (via drill 0.33)
  Top 0.152: v29.57,24.77 29.57,25.69 30.94,27.06 ATSAM4S8B.35 | v28.96,7.1 29.41,7.1 v31.39,9.08 | v32.92,17.76 32.92,18.98 v32.31,19.59
  Bottom 0.152: v29.57,24.77 29.57,21.12 30.48,20.2 30.79,20.2 ESP32-WROOM-32E.16 30.94,20.05 31.39,19.59 v32.31,19.59 | v28.96,7.1 27.43,7.1 25.91,5.57 24.99,5.57 WIFI_HEADER.4 | v31.39,9.08 31.39,16.7 32.46,17.76 v32.92,17.76
VDD1V2  (via drill 0.33)
  Top 0.152: 23.01,20.66 23.01,20.42 22.55,19.96 ATSAM4S8B.12 | 23.01,20.66 23.01,20.73 21.79,21.95 21.64,21.95 21.03,21.34 ATSAM4S8B.8 | 17.22,27.67 18.44,26.45 ATSAM4S8B.64 18.59,26.3 19.81,25.08 20.57,25.08 20.88,25.38 v21.18,25.38 | 17.22,27.67 15.85,29.04 | 15.85,29.04 15.39,29.5 15.39,32.39 C13.1 | 19.05,32.09 19.81,32.09 21.95,29.96 ATSAM4S8B.54 | 19.05,32.09 18.75,32.09 C11.1 | 19.05,32.09 19.05,36.05 18.14,36.97 16.46,36.97 C14.1 | 19.05,32.09 C11.1 | 15.85,29.04 17.37,30.57 17.37,30.87 18.59,32.09 C11.1 | 26.52,21.73 25.76,21.73 24.69,20.66 23.01,20.66 | 26.52,21.73 28.19,21.73 28.96,20.96 ATSAM4S8B.24 | v26.52,22.03 26.52,21.73 | v7.92,24.32 7.92,23.55 4.27,19.9 4.27,15.63 C6.1 | v9.3,24.77 11.73,27.21 15.39,27.21 I1.2 15.54,27.21 15.85,26.91 v16.46,26.91 | v17.37,27.82 17.22,27.67
  Bottom 0.152: v26.52,22.03 25.76,22.03 23.62,24.16 22.4,24.16 v21.18,25.38 | CAM_OV2640.15 6.71,24.32 v7.92,24.32 8.38,24.77 v9.3,24.77 | v16.46,26.91 v17.37,27.82
VDD3V0  (via drill 0.33)
  Top 0.152: R8.2 32.61,32.09 30.18,32.09 29.87,32.39 C15.1 29.72,32.39 29.26,32.39 27.58,30.72 ATSAM4S8B.45 27.43,30.57 26.98,30.11 24.84,30.11 | v40.84,17.15 40.39,17.15 37.95,14.72 33.83,14.72 R9.2 33.68,14.56 29.87,14.56 29.57,14.87 29.57,15.48 | C4.1 11.89,31.94 11.89,33.46 11.28,34.07 C1.1 11.12,34.22 10.52,34.83 | 10.52,34.83 10.52,36.51 R7.2 | 7.16,33.31 7.16,31.48 R2.2 7.16,31.33 7.16,25.54 v5.49,23.86 5.49,21.57 3.05,19.14 3.05,15.63 4.12,14.56 4.42,14.56 5.03,15.17 15.54,15.17 R1.1 15.7,15.17 16.46,15.17 17.07,14.56 v17.68,14.56 | 7.16,33.31 7.16,35.59 C7.1 7.16,35.75 8.99,37.58 8.99,39.1 C5.1 8.99,39.25 6.4,41.84 6.4,46.72 9.14,49.46 24.54,49.46 25.91,48.09 25.91,47.18 27.13,45.96 27.13,45.04 MCU_HEADER.5 27.28,44.89 27.89,44.89 30.33,42.45 30.33,41.84 24.84,36.36 24.84,30.11 | 10.52,34.83 9.91,34.83 8.38,33.31 7.16,33.31 | 24.84,30.11 24.38,30.11 22.25,27.98 21.18,27.98 20.73,28.43 ATSAM4S8B.58 | 29.57,15.48 30.18,16.09 30.79,16.09 C8.1 | 25.76,18.53 28.8,15.48 29.57,15.48 | 25.76,18.53 25.6,18.68 25.6,18.98 26.06,19.44 26.52,18.98 26.82,18.98 ATSAM4S8B.18 | v16.46,23.25 16.46,23.1 18.9,20.66 19.66,20.66 20.57,21.57 ATSAM4S8B.7 | 25.76,18.53 23.93,16.7 v22.1,16.7
  Bottom 0.152: 27.28,38.19 28.04,38.19 VREG-3V3.4 27.28,38.19 | 27.28,38.19 22.4,38.19 VREG-3V3.2 | 27.28,38.19 27.28,44.89 MCU_HEADER.5 | v40.84,17.15 46.48,17.15 47.4,16.24 47.4,15.94 ESP32-WROOM-32E.2 | 5.79,23.86 5.79,21.42 5.94,21.27 6.55,21.27 CAM_OV2640.21 | 5.79,23.86 5.79,24.62 5.94,24.77 6.55,24.77 CAM_OV2640.14 7.47,24.77 8.08,25.38 11.73,25.38 14.48,22.64 15.85,22.64 v16.46,23.25 | 5.79,23.86 v5.49,23.86 | v22.1,16.7 19.81,16.7 v17.68,14.56
VDD5V0  (via drill 0.33)
  Top 0.152: v32.31,10.3 32.31,11.52 C3.1
  Bottom 0.152: v32.31,10.3 32.31,7.71 27.58,2.98 WIFI_HEADER.5 27.43,2.83 26.67,2.83 25.45,1.61 21.39,1.61 20,3 20,7 18,9 14,9 12,7 12,3.92 10.91,2.83 3.81,2.83 2.59,1.61 U$11.PWR1 2.44,1.61 0.91,3.13 0.91,23.4 4.12,26.6 4.12,36.36 7.92,40.17 20.42,40.17 20.73,40.47 22.25,40.47 VREG-3V3.3
VSYNC  (via drill 0.33)
  Top 0.152: v14.17,26.6 v11.89,24.32 | v17.07,32.09 18.75,33.77 18.75,35.9 17.98,36.66 17.07,36.66 16.31,35.9 12.95,35.9 12.04,36.81 11.73,36.81 10.67,37.88 10.67,39.56 11.28,40.17 11.28,44.89 10.52,45.65 10.52,46.57 v12.8,48.85 | v32.61,21.73 32.16,21.73 29.41,18.98 28.04,18.98 27.58,19.44 ATSAM4S8B.20
  Bottom 0.152: v11.89,24.32 10.36,22.79 6.71,22.79 CAM_OV2640.18 | v14.17,26.6 14.17,27.21 17.07,30.11 v17.07,32.09 | v12.8,48.85 19.05,48.85 19.36,49.16 27.43,49.16 31.39,45.2 31.39,31.48 33.38,29.5 33.38,22.79 32.61,22.03 v32.61,21.73
XCLK  (via drill 0.33)
  Top 0.152: 18.9,19.9 v15.54,23.25 | 18.9,19.9 20.42,19.9 21.34,20.81 ATSAM4S8B.9 | v39.78,14.11 39.78,3.29 37.19,0.69 24.08,0.69 23.62,1.15 23.62,10.3 v21.18,12.73 | v21.18,14.56 18.29,17.46 18.29,19.29 18.9,19.9
  Bottom 0.152: v15.54,23.25 14.33,23.25 11.89,25.69 6.71,25.69 CAM_OV2640.12 | v39.78,14.11 39.78,15.78 ESP32-WROOM-32E.8 | v21.18,14.56 v21.18,12.73
XTAL1  (via drill 0.33)
  Top 0.152: 18.44,27.98 19.2,27.21 ATSAM4S8B.62 | 18.44,27.98 17.83,28.58 17.83,29.19 C12.1 | v18.29,27.98 18.44,27.98 | v16.61,25.23 13.56,22.18 13.56,19.59 20.57,12.58 20.57,12.28 v21.34,11.52
  Bottom 0.152: v18.29,27.98 18.29,26.91 v16.61,25.23 | v21.34,11.52 21.95,11.52 22.71,10.75 XTAL_12MHZ.1
XTAL2  (via drill 0.33)
  Top 0.152: C16.1 29.26,11.06 v28.65,11.67 26.98,13.34 20.27,13.34 13.87,19.75 13.87,20.51 v15.39,22.03 | v20.27,25.69 20.27,26.76 19.66,27.36 ATSAM4S8B.61
  Bottom 0.152: v28.65,11.67 28.19,11.67 27.28,10.75 XTAL_12MHZ.2 | v20.27,25.69 19.81,25.69 16.15,22.03 v15.39,22.03

### Text on the board
tPlace: NET | POWER | WS | AP | Darling, U look | perfect tonight | Yutong & Xu
bPlace: SWDIO | NRST | GND | SWDCLK | SWO | 3V | DATE:2025/02/19 | V1.0 | NAME:MyWebCam | RX_MCU | TX_MCU | GND | TX_DBG | 5V | RX_DBG